# Altium schematic sheet BLOCK DIAGRAM.SchDoc
size A; SheetNumber: 3; SheetTotal: 13
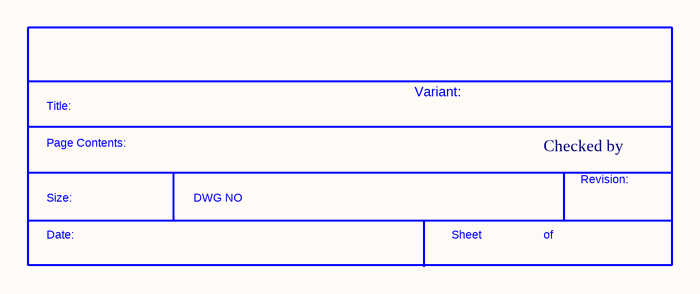
[diagram p0: BLOCK DIAGRAM.SchDoc]

## Parts
*?  SDTitleBlock  (value not drawn)  (graphical)

## Notes on the sheet
- Variant:
- Checked by
- (in symbol SDTitleBlock) Title:; Page Contents:; Revision:; Size:; DWG NO; Date:; Sheet; of